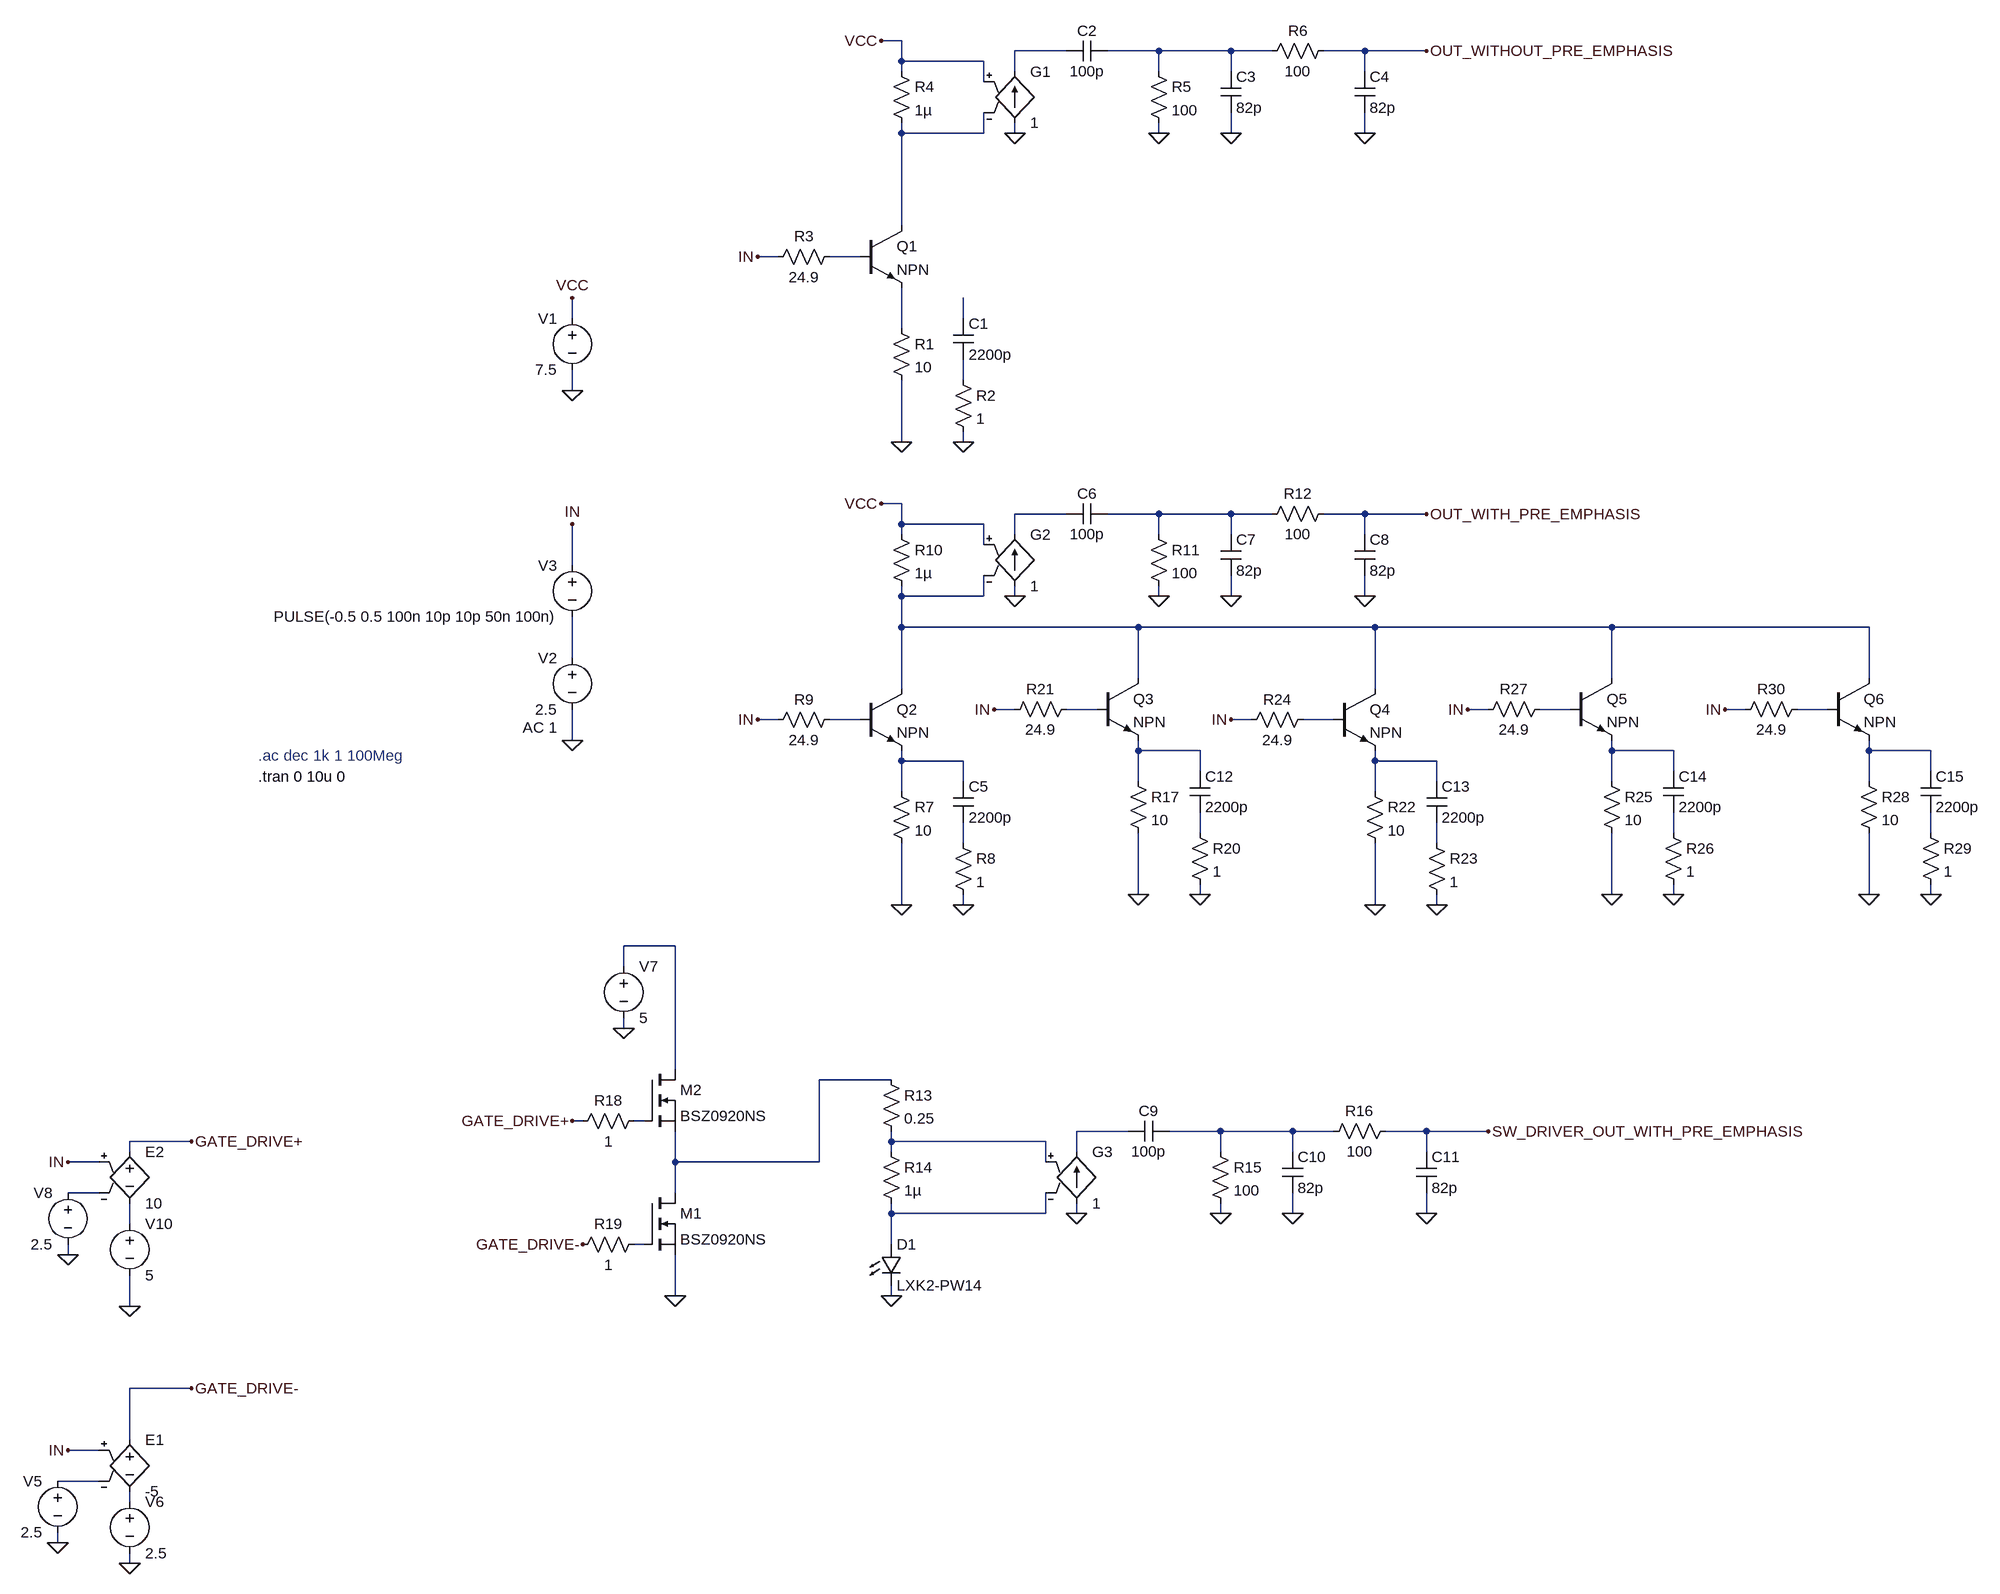
[diagram p0: schematic 1st_Order_Sim.asc]
1st_Order_Sim.asc, the LTspice schematic file:
Version 4
SHEET 1 2212 2216
WIRE 528 -368 496 -368
WIRE 784 -352 704 -352
WIRE 928 -352 848 -352
WIRE 1040 -352 928 -352
WIRE 1104 -352 1040 -352
WIRE 1248 -352 1184 -352
WIRE 1344 -352 1248 -352
WIRE 528 -336 528 -368
WIRE 656 -336 528 -336
WIRE 528 -320 528 -336
WIRE 704 -320 704 -352
WIRE 928 -320 928 -352
WIRE 1040 -320 1040 -352
WIRE 1248 -320 1248 -352
WIRE 656 -304 656 -336
WIRE 528 -224 528 -240
WIRE 656 -224 656 -256
WIRE 656 -224 528 -224
WIRE 704 -224 704 -240
WIRE 928 -224 928 -240
WIRE 1040 -224 1040 -256
WIRE 1248 -224 1248 -256
WIRE 528 -80 528 -224
WIRE 336 -32 304 -32
WIRE 464 -32 416 -32
WIRE 16 64 16 32
WIRE 624 64 624 32
WIRE 528 80 528 16
WIRE 624 160 624 128
WIRE 16 176 16 144
WIRE 528 256 528 160
WIRE 624 256 624 240
WIRE 528 352 496 352
WIRE 784 368 704 368
WIRE 928 368 848 368
WIRE 1040 368 928 368
WIRE 1104 368 1040 368
WIRE 1248 368 1184 368
WIRE 1344 368 1248 368
WIRE 528 384 528 352
WIRE 656 384 528 384
WIRE 528 400 528 384
WIRE 704 400 704 368
WIRE 928 400 928 368
WIRE 1040 400 1040 368
WIRE 1248 400 1248 368
WIRE 656 416 656 384
WIRE 16 448 16 384
WIRE 528 496 528 480
WIRE 656 496 656 464
WIRE 656 496 528 496
WIRE 704 496 704 480
WIRE 928 496 928 480
WIRE 1040 496 1040 464
WIRE 1248 496 1248 464
WIRE 528 544 528 496
WIRE 896 544 528 544
WIRE 1264 544 896 544
WIRE 1632 544 1264 544
WIRE 2032 544 1632 544
WIRE 16 592 16 528
WIRE 896 624 896 544
WIRE 1632 624 1632 544
WIRE 2032 624 2032 544
WIRE 528 640 528 544
WIRE 1264 640 1264 544
WIRE 704 672 672 672
WIRE 832 672 784 672
WIRE 1440 672 1408 672
WIRE 1568 672 1520 672
WIRE 1840 672 1808 672
WIRE 1968 672 1920 672
WIRE 336 688 304 688
WIRE 464 688 416 688
WIRE 1072 688 1040 688
WIRE 1200 688 1152 688
WIRE 16 720 16 672
WIRE 896 736 896 720
WIRE 992 736 896 736
WIRE 1632 736 1632 720
WIRE 1728 736 1632 736
WIRE 2032 736 2032 720
WIRE 2128 736 2032 736
WIRE 528 752 528 736
WIRE 624 752 528 752
WIRE 1264 752 1264 736
WIRE 1360 752 1264 752
WIRE 992 768 992 736
WIRE 1728 768 1728 736
WIRE 2128 768 2128 736
WIRE 624 784 624 752
WIRE 896 784 896 736
WIRE 1360 784 1360 752
WIRE 1632 784 1632 736
WIRE 2032 784 2032 736
WIRE 528 800 528 752
WIRE 1264 800 1264 752
WIRE 992 864 992 832
WIRE 1728 864 1728 832
WIRE 2128 864 2128 832
WIRE 624 880 624 848
WIRE 1360 880 1360 848
WIRE 896 960 896 864
WIRE 992 960 992 944
WIRE 1632 960 1632 864
WIRE 1728 960 1728 944
WIRE 2032 960 2032 864
WIRE 2128 960 2128 944
WIRE 528 976 528 880
WIRE 624 976 624 960
WIRE 1264 976 1264 880
WIRE 1360 976 1360 960
WIRE 176 1040 96 1040
WIRE 96 1072 96 1040
WIRE 96 1168 96 1152
WIRE 176 1232 176 1040
WIRE 512 1248 400 1248
WIRE 32 1312 16 1312
WIRE 128 1312 112 1312
WIRE 880 1328 800 1328
WIRE 1024 1328 944 1328
WIRE 1136 1328 1024 1328
WIRE 1200 1328 1136 1328
WIRE 1344 1328 1280 1328
WIRE 1440 1328 1344 1328
WIRE -576 1344 -672 1344
WIRE 512 1344 512 1328
WIRE 752 1344 512 1344
WIRE -672 1360 -672 1344
WIRE 512 1360 512 1344
WIRE 800 1360 800 1328
WIRE 1024 1360 1024 1328
WIRE 1136 1360 1136 1328
WIRE 1344 1360 1344 1328
WIRE -720 1376 -768 1376
WIRE 176 1376 176 1328
WIRE 400 1376 400 1248
WIRE 400 1376 176 1376
WIRE 752 1376 752 1344
WIRE -720 1424 -768 1424
WIRE 176 1424 176 1376
WIRE 512 1456 512 1440
WIRE 752 1456 752 1424
WIRE 752 1456 512 1456
WIRE 800 1456 800 1440
WIRE 1024 1456 1024 1440
WIRE 1136 1456 1136 1424
WIRE 1344 1456 1344 1424
WIRE -672 1472 -672 1440
WIRE 128 1504 112 1504
WIRE 512 1504 512 1456
WIRE -768 1520 -768 1504
WIRE 176 1584 176 1520
WIRE 512 1584 512 1568
WIRE -672 1600 -672 1552
WIRE -576 1728 -672 1728
WIRE -672 1808 -672 1728
WIRE -720 1824 -768 1824
WIRE -720 1872 -784 1872
WIRE -672 1904 -672 1888
WIRE -784 1968 -784 1952
WIRE -672 2000 -672 1984
FLAG 16 176 0
FLAG 16 32 VCC
FLAG 16 720 0
FLAG 16 384 IN
FLAG 528 256 0
FLAG 624 256 0
FLAG 496 -368 VCC
FLAG 704 -224 0
FLAG 928 -224 0
FLAG 1248 -224 0
FLAG 1040 -224 0
FLAG 1344 -352 OUT_WITHOUT_PRE_EMPHASIS
FLAG 304 -32 IN
FLAG 528 976 0
FLAG 624 976 0
FLAG 496 352 VCC
FLAG 704 496 0
FLAG 928 496 0
FLAG 1248 496 0
FLAG 1040 496 0
FLAG 1344 368 OUT_WITH_PRE_EMPHASIS
FLAG 304 688 IN
FLAG 800 1456 0
FLAG 1024 1456 0
FLAG 1344 1456 0
FLAG 1136 1456 0
FLAG 1440 1328 SW_DRIVER_OUT_WITH_PRE_EMPHASIS
FLAG 176 1584 0
FLAG -768 1824 IN
FLAG -784 1968 0
FLAG -672 2000 0
FLAG 96 1168 0
FLAG -768 1376 IN
FLAG -768 1520 0
FLAG -672 1600 0
FLAG -576 1344 GATE_DRIVE+
FLAG -576 1728 GATE_DRIVE-
FLAG 32 1504 GATE_DRIVE-
FLAG 16 1312 GATE_DRIVE+
FLAG 512 1584 0
FLAG 896 960 0
FLAG 992 960 0
FLAG 672 672 IN
FLAG 1264 976 0
FLAG 1360 976 0
FLAG 1040 688 IN
FLAG 1632 960 0
FLAG 1728 960 0
FLAG 1408 672 IN
FLAG 2032 960 0
FLAG 2128 960 0
FLAG 1808 672 IN
SYMBOL voltage 16 48 M0
WINDOW 123 0 0 Left 0
WINDOW 39 0 0 Left 0
SYMATTR InstName V1
SYMATTR Value 7.5
SYMBOL voltage 16 576 M0
WINDOW 123 24 124 Left 2
WINDOW 39 0 0 Left 0
SYMATTR InstName V2
SYMATTR Value 2.5
SYMATTR Value2 AC 1
SYMBOL npn 464 -80 R0
SYMATTR InstName Q1
SYMBOL res 512 64 R0
SYMATTR InstName R1
SYMATTR Value 10
SYMBOL cap 608 64 R0
SYMATTR InstName C1
SYMATTR Value 2200p
SYMBOL res 608 144 R0
SYMATTR InstName R2
SYMATTR Value 1
SYMBOL res 432 -48 R90
WINDOW 0 0 56 VBottom 2
WINDOW 3 32 56 VTop 2
SYMATTR InstName R3
SYMATTR Value 24.9
SYMBOL res 512 -336 R0
SYMATTR InstName R4
SYMATTR Value 1µ
SYMBOL g 704 -336 R0
SYMATTR InstName G1
SYMATTR Value 1
SYMBOL cap 848 -368 R90
WINDOW 0 0 32 VBottom 2
WINDOW 3 32 32 VTop 2
SYMATTR InstName C2
SYMATTR Value 100p
SYMBOL res 912 -336 R0
SYMATTR InstName R5
SYMATTR Value 100
SYMBOL cap 1024 -256 M180
WINDOW 0 24 56 Left 2
WINDOW 3 24 8 Left 2
SYMATTR InstName C3
SYMATTR Value 82p
SYMBOL res 1200 -368 R90
WINDOW 0 0 56 VBottom 2
WINDOW 3 32 56 VTop 2
SYMATTR InstName R6
SYMATTR Value 100
SYMBOL cap 1232 -256 M180
WINDOW 0 24 56 Left 2
WINDOW 3 24 8 Left 2
SYMATTR InstName C4
SYMATTR Value 82p
SYMBOL voltage 16 432 M0
WINDOW 123 0 0 Left 0
WINDOW 39 0 0 Left 0
SYMATTR InstName V3
SYMATTR Value PULSE(-0.5 0.5 100n 10p 10p 50n 100n)
SYMBOL npn 464 640 R0
SYMATTR InstName Q2
SYMBOL res 512 784 R0
SYMATTR InstName R7
SYMATTR Value 10
SYMBOL cap 608 784 R0
SYMATTR InstName C5
SYMATTR Value 2200p
SYMBOL res 608 864 R0
SYMATTR InstName R8
SYMATTR Value 1
SYMBOL res 432 672 R90
WINDOW 0 0 56 VBottom 2
WINDOW 3 32 56 VTop 2
SYMATTR InstName R9
SYMATTR Value 24.9
SYMBOL res 512 384 R0
SYMATTR InstName R10
SYMATTR Value 1µ
SYMBOL g 704 384 R0
SYMATTR InstName G2
SYMATTR Value 1
SYMBOL cap 848 352 R90
WINDOW 0 0 32 VBottom 2
WINDOW 3 32 32 VTop 2
SYMATTR InstName C6
SYMATTR Value 100p
SYMBOL res 912 384 R0
SYMATTR InstName R11
SYMATTR Value 100
SYMBOL cap 1024 464 M180
WINDOW 0 24 56 Left 2
WINDOW 3 24 8 Left 2
SYMATTR InstName C7
SYMATTR Value 82p
SYMBOL res 1200 352 R90
WINDOW 0 0 56 VBottom 2
WINDOW 3 32 56 VTop 2
SYMATTR InstName R12
SYMATTR Value 100
SYMBOL cap 1232 464 M180
WINDOW 0 24 56 Left 2
WINDOW 3 24 8 Left 2
SYMATTR InstName C8
SYMATTR Value 82p
SYMBOL nmos 128 1424 R0
SYMATTR InstName M1
SYMATTR Value BSZ0920NS
SYMBOL res 496 1232 R0
SYMATTR InstName R13
SYMATTR Value 0.25
SYMBOL res 496 1344 R0
SYMATTR InstName R14
SYMATTR Value 1µ
SYMBOL g 800 1344 R0
SYMATTR InstName G3
SYMATTR Value 1
SYMBOL cap 944 1312 R90
WINDOW 0 0 32 VBottom 2
WINDOW 3 32 32 VTop 2
SYMATTR InstName C9
SYMATTR Value 100p
SYMBOL res 1008 1344 R0
SYMATTR InstName R15
SYMATTR Value 100
SYMBOL cap 1120 1424 M180
WINDOW 0 24 56 Left 2
WINDOW 3 24 8 Left 2
SYMATTR InstName C10
SYMATTR Value 82p
SYMBOL res 1296 1312 R90
WINDOW 0 0 56 VBottom 2
WINDOW 3 32 56 VTop 2
SYMATTR InstName R16
SYMATTR Value 100
SYMBOL cap 1328 1424 M180
WINDOW 0 24 56 Left 2
WINDOW 3 24 8 Left 2
SYMATTR InstName C11
SYMATTR Value 82p
SYMBOL e -672 1792 R0
SYMATTR InstName E1
SYMATTR Value -5
SYMBOL voltage -784 1856 M0
WINDOW 123 24 124 Left 2
WINDOW 39 0 0 Left 0
SYMATTR InstName V5
SYMATTR Value 2.5
SYMBOL voltage -672 1888 R0
WINDOW 123 24 124 Left 2
WINDOW 39 0 0 Left 0
SYMATTR InstName V6
SYMATTR Value 2.5
SYMBOL voltage 96 1056 R0
WINDOW 123 24 124 Left 2
WINDOW 39 0 0 Left 0
SYMATTR InstName V7
SYMATTR Value 5
SYMBOL nmos 128 1232 R0
SYMATTR InstName M2
SYMATTR Value BSZ0920NS
SYMBOL e -672 1344 R0
SYMATTR InstName E2
SYMATTR Value 10
SYMBOL voltage -768 1408 M0
WINDOW 123 24 124 Left 2
WINDOW 39 0 0 Left 0
SYMATTR InstName V8
SYMATTR Value 2.5
SYMBOL voltage -672 1456 R0
WINDOW 123 24 124 Left 2
WINDOW 39 0 0 Left 0
SYMATTR InstName V10
SYMATTR Value 5
SYMBOL LED 496 1504 R0
SYMATTR InstName D1
SYMATTR Value LXK2-PW14
SYMATTR Description Diode
SYMATTR Type diode
SYMBOL res 128 1296 R90
WINDOW 0 0 56 VBottom 2
WINDOW 3 32 56 VTop 2
SYMATTR InstName R18
SYMATTR Value 1
SYMBOL res 128 1488 R90
WINDOW 0 0 56 VBottom 2
WINDOW 3 32 56 VTop 2
SYMATTR InstName R19
SYMATTR Value 1
SYMBOL npn 832 624 R0
SYMATTR InstName Q3
SYMBOL res 880 768 R0
SYMATTR InstName R17
SYMATTR Value 10
SYMBOL cap 976 768 R0
SYMATTR InstName C12
SYMATTR Value 2200p
SYMBOL res 976 848 R0
SYMATTR InstName R20
SYMATTR Value 1
SYMBOL res 800 656 R90
WINDOW 0 0 56 VBottom 2
WINDOW 3 32 56 VTop 2
SYMATTR InstName R21
SYMATTR Value 24.9
SYMBOL npn 1200 640 R0
SYMATTR InstName Q4
SYMBOL res 1248 784 R0
SYMATTR InstName R22
SYMATTR Value 10
SYMBOL cap 1344 784 R0
SYMATTR InstName C13
SYMATTR Value 2200p
SYMBOL res 1344 864 R0
SYMATTR InstName R23
SYMATTR Value 1
SYMBOL res 1168 672 R90
WINDOW 0 0 56 VBottom 2
WINDOW 3 32 56 VTop 2
SYMATTR InstName R24
SYMATTR Value 24.9
SYMBOL npn 1568 624 R0
SYMATTR InstName Q5
SYMBOL res 1616 768 R0
SYMATTR InstName R25
SYMATTR Value 10
SYMBOL cap 1712 768 R0
SYMATTR InstName C14
SYMATTR Value 2200p
SYMBOL res 1712 848 R0
SYMATTR InstName R26
SYMATTR Value 1
SYMBOL res 1536 656 R90
WINDOW 0 0 56 VBottom 2
WINDOW 3 32 56 VTop 2
SYMATTR InstName R27
SYMATTR Value 24.9
SYMBOL npn 1968 624 R0
SYMATTR InstName Q6
SYMBOL res 2016 768 R0
SYMATTR InstName R28
SYMATTR Value 10
SYMBOL cap 2112 768 R0
SYMATTR InstName C15
SYMATTR Value 2200p
SYMBOL res 2112 848 R0
SYMATTR InstName R29
SYMATTR Value 1
SYMBOL res 1936 656 R90
WINDOW 0 0 56 VBottom 2
WINDOW 3 32 56 VTop 2
SYMATTR InstName R30
SYMATTR Value 24.9
TEXT -472 744 Left 2 ;.ac dec 1k 1 100Meg
TEXT -472 776 Left 2 !.tran 0 10u 0

The netlist it stands for:
* 1st_Order_Sim.asc
V1 VCC 0 7.5
V2 N011 0 2.5 AC 1
Q1 N003 N004 N006 0 NPN
R1 N006 0 10
C1 N005 N007 2200p
R2 N007 0 1
R3 N004 IN 24.9
R4 VCC N003 1µ
G1 0 N001 VCC N003 1
C2 N002 N001 100p
R5 N002 0 100
C3 0 N002 82p
R6 OUT_WITHOUT_PRE_EMPHASIS N002 100
C4 0 OUT_WITHOUT_PRE_EMPHASIS 82p
V3 IN N011 PULSE(-0.5 0.5 100n 10p 10p 50n 100n)
Q2 N010 N015 N020 0 NPN
R7 N020 0 10
C5 N020 N025 2200p
R8 N025 0 1
R9 N015 IN 24.9
R10 VCC N010 1µ
G2 0 N008 VCC N010 1
C6 N009 N008 100p
R11 N009 0 100
C7 0 N009 82p
R12 OUT_WITH_PRE_EMPHASIS N009 100
C8 0 OUT_WITH_PRE_EMPHASIS 82p
M1 N028 N036 0 0 BSZ0920NS
R13 N028 N032 0.25
R14 N032 N034 1µ
G3 0 N030 N032 N034 1
C9 N031 N030 100p
R15 N031 0 100
C10 0 N031 82p
R16 SW_DRIVER_OUT_WITH_PRE_EMPHASIS N031 100
C11 0 SW_DRIVER_OUT_WITH_PRE_EMPHASIS 82p
E1 GATE_DRIVE- N038 IN N037 -5
V5 N037 0 2.5
V6 N038 0 2.5
V7 N027 0 5
M2 N027 N029 N028 N028 BSZ0920NS
E2 GATE_DRIVE+ N035 IN N033 10
V8 N033 0 2.5
V10 N035 0 5
D1 N034 0 LXK2-PW14
R18 N029 GATE_DRIVE+ 1
R19 N036 GATE_DRIVE- 1
Q3 N010 N012 N017 0 NPN
R17 N017 0 10
C12 N017 N022 2200p
R20 N022 0 1
R21 N012 IN 24.9
Q4 N010 N016 N021 0 NPN
R22 N021 0 10
C13 N021 N026 2200p
R23 N026 0 1
R24 N016 IN 24.9
Q5 N010 N013 N018 0 NPN
R25 N018 0 10
C14 N018 N023 2200p
R26 N023 0 1
R27 N013 IN 24.9
Q6 N010 N014 N019 0 NPN
R28 N019 0 10
C15 N019 N024 2200p
R29 N024 0 1
R30 N014 IN 24.9
.model D D
.lib standard.dio
.model NPN NPN
.model PNP PNP
.lib standard.bjt
.model NMOS NMOS
.model PMOS PMOS
.lib standard.mos
* .ac dec 1k 1 100Meg
.tran 0 10u 0
.backanno
.end